# Altium project MainPCBV6.PrjPcb
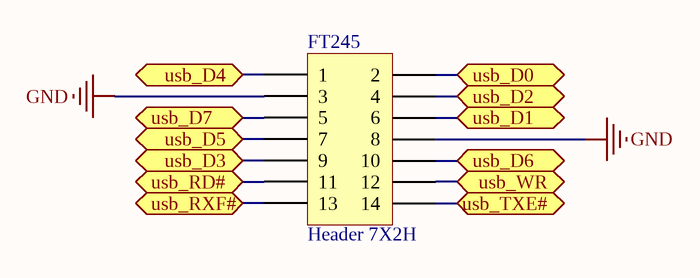
[diagram p0: FT245.SchDoc]
3 sheets, 46 parts. Net scope: flat (ports and power ports of the same name join across sheets).
Board file: MainPCBV6.PcbDoc
Sheets:
  FT245.SchDoc
  Led.SchDoc
  XC3S400.SchDoc

## Sheet FT245.SchDoc
size A4

### Parts
FT245  Header 7X2H  [HDR2X7]

### Ports
usb_D0, usb_D1, usb_D2, usb_D3, usb_D4, usb_D5, usb_D6, usb_D7, usb_RD#, usb_RXF#, usb_TXE#, usb_WR

### Nets
GND: FT245.3 FT245.8
NetFT245_1: FT245.1 ; port usb_D4
NetFT245_2: FT245.2 ; port usb_D0
NetFT245_4: FT245.4 ; port usb_D2
NetFT245_5: FT245.5 ; port usb_D7
NetFT245_6: FT245.6 ; port usb_D1
NetFT245_7: FT245.7 ; port usb_D5
NetFT245_9: FT245.9 ; port usb_D3
NetFT245_10: FT245.10 ; port usb_D6
NetFT245_11: FT245.11 ; port usb_RD#
NetFT245_12: FT245.12 ; port usb_WR
NetFT245_13: FT245.13 ; port usb_RXF#
NetFT245_14: FT245.14 ; port usb_TXE#

### Library data of the parts
FT245 = Header 7X2H: Header, 7-Pin, Dual row, Right Angle; LatestRevisionDate: 17-Jul-2002; LatestRevisionNote: Re-released for DXP Platform.; Publisher: Altium Limited

## Sheet Led.SchDoc
size A
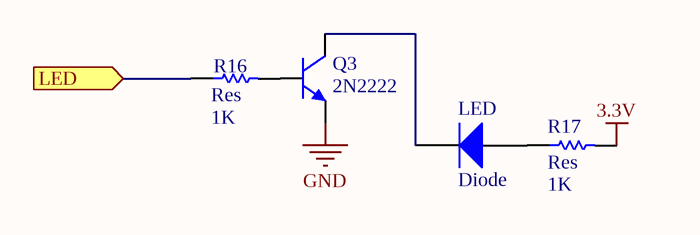
[diagram p1: Led.SchDoc]

### Parts
LED  Diode  [2012[0805]]
Q3  2N2222  [SOT-23]
R16  Res  value 1K  [2012[0805]]
R17  Res  value 1K  [2012[0805]]

### Ports
LED (in)

### Nets
3.3V: R17.2
GND: Q3.3(E)
NetLED_1: LED.1(A) R17.1
NetLED_2: LED.2(K) Q3.1(C)
NetQ3_2: Q3.2(B) R16.2
NetR16_1: R16.1 ; port LED

### Library data of the parts
LED = Diode: 1 Amp General Purpose Rectifier; Revision 1: 11-Jul-2000: SIM Model Added.; Revision 2: 17-Jul-2002: Re-released for DXP Platform.; Package Information: Latest Revision: Aug-1999; Code - JEDEC: DO-204-AL; Published: 8-Jun-2000; Datasheet: Latest Revision: 1998; Package Reference: DO-41; Publisher: Altium Limited
Q3 = 2N2222: NPN Bipolar Transistor; Published: 8-Jun-2000; LatestRevisionDate: 17-Jul-2002; LatestRevisionNote: Re-released for DXP Platform.; PackageReference: TO-226; Publisher: Altium Limited; Code_JEDEC: TO-226-AA
R16 R17 = Res: Semiconductor Resistor; Published: 8-Jun-2000; LatestRevisionDate: 17-Jul-2002; LatestRevisionNote: Re-released for DXP Platform.; PackageReference: AXIAL-0.5; Publisher: Altium Limited

## Sheet XC3S400.SchDoc
size B
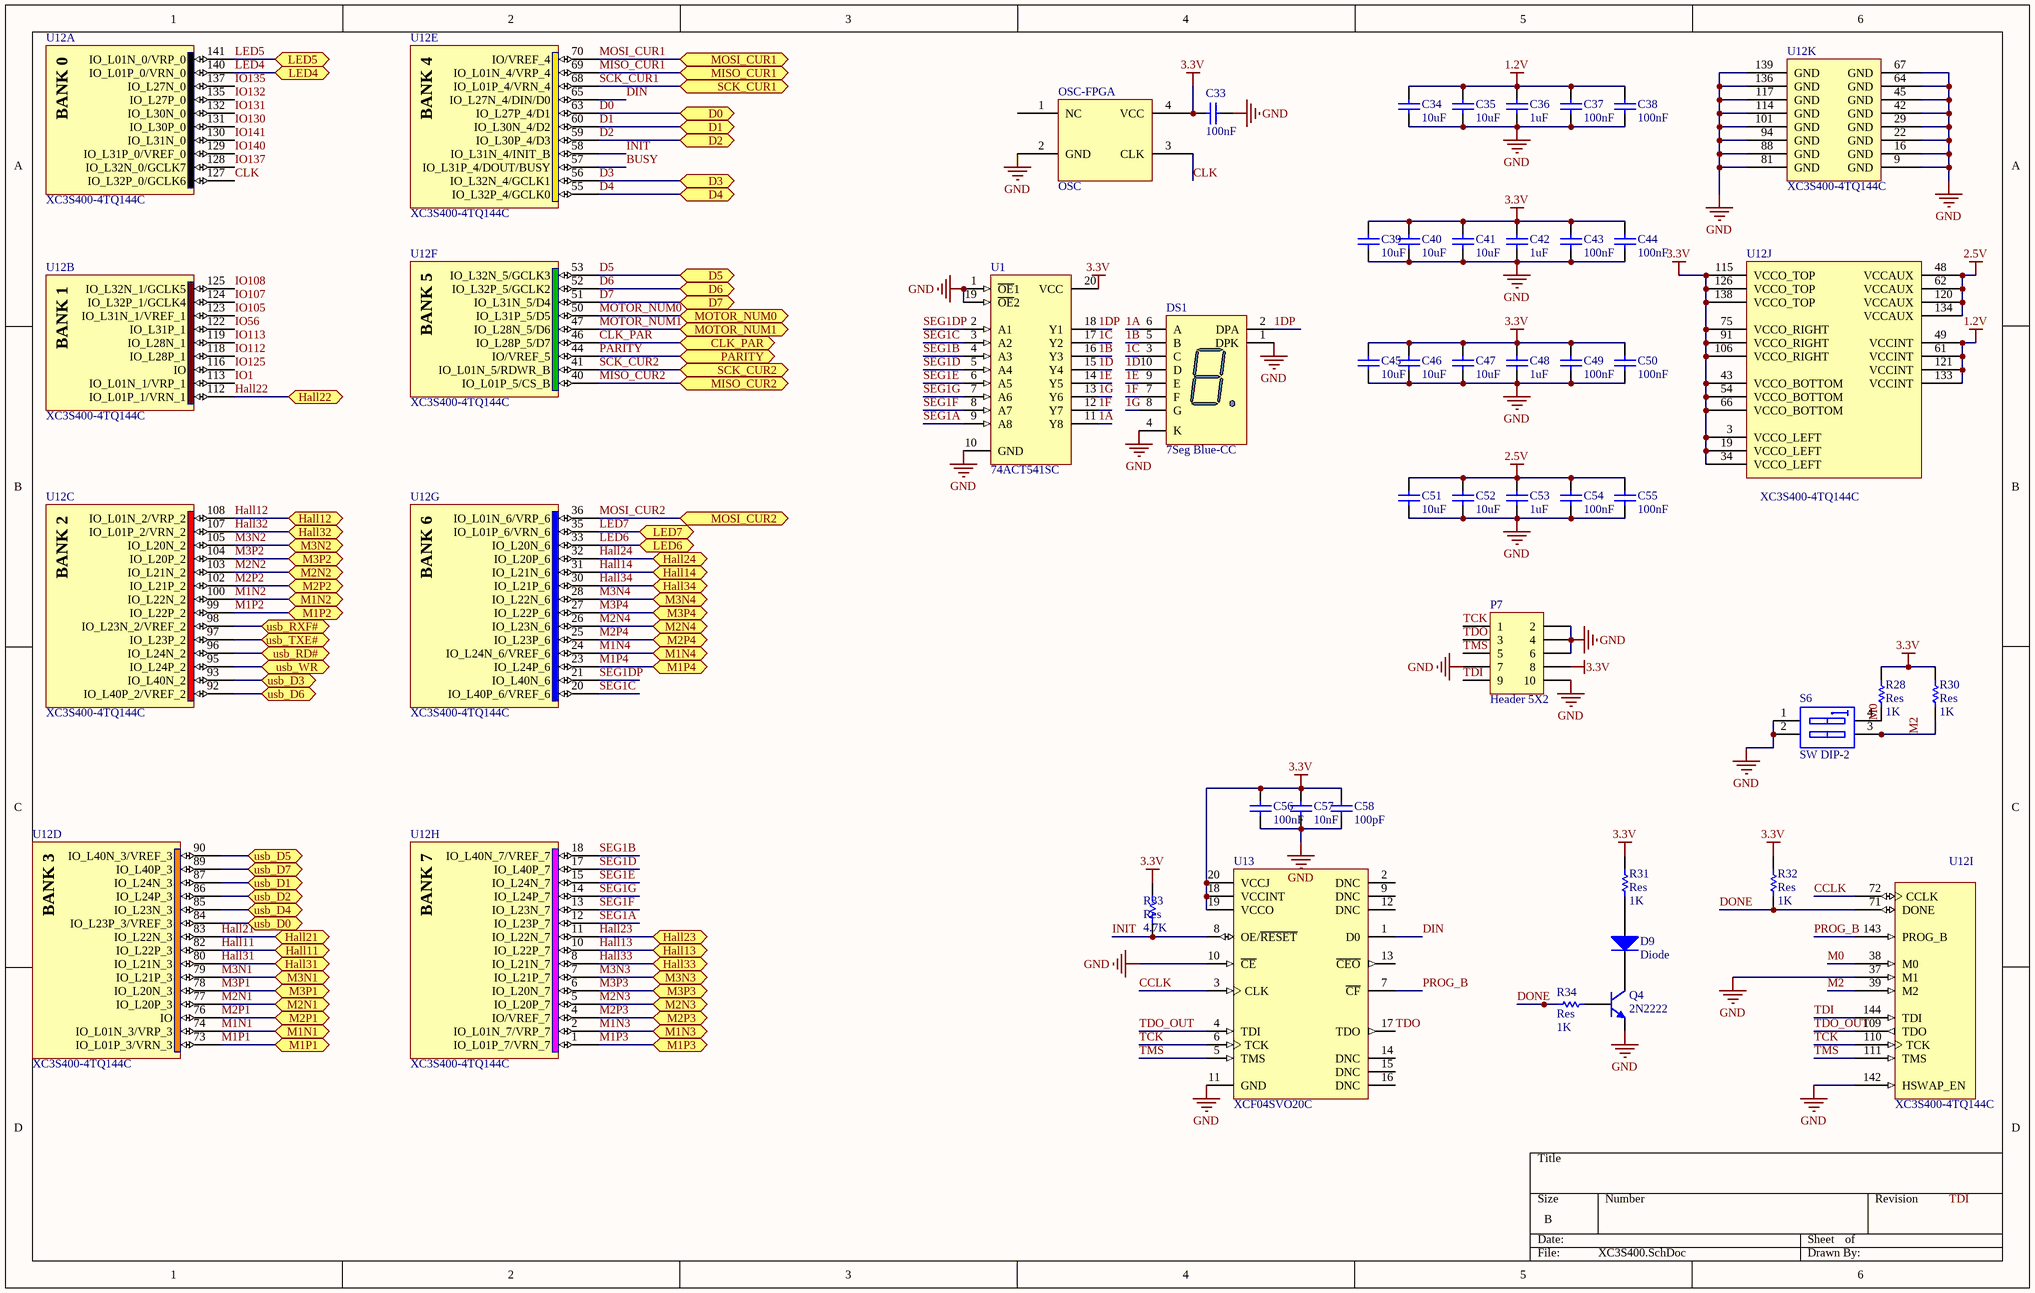
[diagram p2: XC3S400.SchDoc]

### Parts
C33  value 100nF  [2012[0805]]  (hidden comment: Cap_UP)
C34  value 10uF  [2012[0805]]  (hidden comment: Cap_UP)
C35  value 10uF  [2012[0805]]  (hidden comment: Cap_UP)
C36  value 1uF  [2012[0805]]  (hidden comment: Cap_UP)
C37  value 100nF  [2012[0805]]  (hidden comment: Cap_UP)
C38  value 100nF  [2012[0805]]  (hidden comment: Cap_UP)
C39  value 10uF  [2012[0805]]  (hidden comment: Cap_UP)
C40  value 10uF  [2012[0805]]  (hidden comment: Cap_UP)
C41  value 10uF  [2012[0805]]  (hidden comment: Cap_UP)
C42  value 1uF  [2012[0805]]  (hidden comment: Cap_UP)
C43  value 100nF  [2012[0805]]  (hidden comment: Cap_UP)
C44  value 100nF  [2012[0805]]  (hidden comment: Cap_UP)
C45  value 10uF  [2012[0805]]  (hidden comment: Cap_UP)
C46  value 10uF  [2012[0805]]  (hidden comment: Cap_UP)
C47  value 10uF  [2012[0805]]  (hidden comment: Cap_UP)
C48  value 1uF  [2012[0805]]  (hidden comment: Cap_UP)
C49  value 100nF  [2012[0805]]  (hidden comment: Cap_UP)
C50  value 100nF  [2012[0805]]  (hidden comment: Cap_UP)
C51  value 10uF  [2012[0805]]  (hidden comment: Cap_UP)
C52  value 10uF  [2012[0805]]  (hidden comment: Cap_UP)
C53  value 1uF  [2012[0805]]  (hidden comment: Cap_UP)
C54  value 100nF  [2012[0805]]  (hidden comment: Cap_UP)
C55  value 100nF  [2012[0805]]  (hidden comment: Cap_UP)
C56  value 100nF  [2012[0805]]  (hidden comment: Cap_UP)
C57  value 10nF  [2012[0805]]  (hidden comment: Cap_UP)
C58  value 100pF  [2012[0805]]  (hidden comment: Cap_UP)
D9  Diode  [2012[0805]]
DS1  7Seg Blue-CC  [7Segment Small]
OSC-FPGA  OSC  [OSC_square]
P7  Header 5X2  [HDR2X5]
Q4  2N2222  [SOT-23]
R28  Res  value 1K  [2012[0805]]
R30  Res  value 1K  [2012[0805]]
R31  Res  value 1K  [2012[0805]]
R32  Res  value 1K  [2012[0805]]
R33  Res  value 4.7K  [2012[0805]]
R34  Res  value 1K  [2012[0805]]
S6  SW DIP-2  [DIP-4]
U1  74ACT541SC  [M20B_M]
U12  XC3S400-4TQ144C  [TQ144_N]  (parts A,B,C,D,E,F,G,H,I,J,K of 11)
U13  XCF04SVO20C  [VO20_N]

### Ports
CLK_PAR, D0, D1, D2, D3, D4, D5, D6, D7, Hall11, Hall12, Hall13, Hall14, Hall21, Hall22, Hall23, Hall24, Hall31, Hall32, Hall33, Hall34, LED4, LED5, LED6, LED7, M1N1, M1N2, M1N3, M1N4, M1P1, M1P2, M1P3, M1P4, M2N1, M2N2, M2N3, M2N4, M2P1, M2P2, M2P3, M2P4, M3N1, M3N2, M3N3, M3N4, M3P1, M3P2, M3P3, M3P4, MISO_CUR1, MISO_CUR2, MOSI_CUR1, MOSI_CUR2, MOTOR_NUM0, MOTOR_NUM1, PARITY, SCK_CUR1, SCK_CUR2, usb_D0, usb_D1, usb_D2, usb_D3, usb_D4, usb_D5, usb_D6, usb_D7, usb_RD#, usb_RXF#, usb_TXE#, usb_WR

### Nets
1.2V: C34.2 C35.2 C36.2 C37.2 C38.2 U12.49(VCCINT) U12.61(VCCINT) U12.121(VCCINT) U12.133(VCCINT)
2.5V: C51.2 C52.2 C53.2 C54.2 C55.2 U12.48(VCCAUX) U12.62(VCCAUX) U12.120(VCCAUX) U12.134(VCCAUX)
3.3V: C33.1 C39.2 C40.2 C41.2 C42.2 C43.2 C44.2 C45.2 C46.2 C47.2 C48.2 C49.2 C50.2 C56.2 C57.2 C58.2 OSC-FPGA.4(VCC) P7.8 R28.2 R30.2 R31.2 R32.2 R33.2 U1.20(VCC) U12.3(VCCO_LEFT) U12.19(VCCO_LEFT) U12.34(VCCO_LEFT) U12.43(VCCO_BOTTOM) U12.54(VCCO_BOTTOM) U12.66(VCCO_BOTTOM) U12.75(VCCO_RIGHT) U12.91(VCCO_RIGHT) U12.106(VCCO_RIGHT) U12.115(VCCO_TOP) U12.126(VCCO_TOP) U12.138(VCCO_TOP) U13.18(VCCINT) U13.19(VCCO) U13.20(VCCJ)
GND: C33.2 C34.1 C35.1 C36.1 C37.1 C38.1 C39.1 C40.1 C41.1 C42.1 C43.1 C44.1 C45.1 C46.1 C47.1 C48.1 C49.1 C50.1 C51.1 C52.1 C53.1 C54.1 C55.1 C56.1 C57.1 C58.1 DS1.1(DPK) DS1.4(K) OSC-FPGA.2(GND) P7.2 P7.4 P7.6 P7.7 P7.10 Q4.3(E) S6.1(A1) S6.2(A2) U1.1(~{OE}1) U1.10(GND) U1.19(~{OE}2) U12.9(GND) U12.16(GND) U12.22(GND) U12.29(GND) U12.37(M1) U12.42(GND) U12.45(GND) U12.64(GND) U12.67(GND) U12.81(GND) U12.88(GND) U12.94(GND) U12.101(GND) U12.114(GND) U12.117(GND) U12.136(GND) U12.139(GND) U12.142(HSWAP_EN) U13.10(~{CE}) U13.11(GND)
1A: DS1.6(A) U1.11(Y8)
1B: DS1.5(B) U1.16(Y3)
1C: DS1.3(C) U1.17(Y2)
1D: DS1.10(D) U1.15(Y4)
1DP: DS1.2(DPA) U1.18(Y1)
1E: DS1.9(E) U1.14(Y5)
1F: DS1.7(F) U1.12(Y7)
1G: DS1.8(G) U1.13(Y6)
BUSY: U12.57(IO_L31P_4/DOUT/BUSY)
CCLK: U12.72(CCLK) U13.3(CLK)
CLK: OSC-FPGA.3(CLK) U12.127(IO_L32P_0/GCLK6)
CLK_PAR: U12.46(IO_L28P_5/D7) ; port CLK_PAR
D0: U12.63(IO_L27P_4/D1) ; port D0
D1: U12.60(IO_L30N_4/D2) ; port D1
D2: U12.59(IO_L30P_4/D3) ; port D2
D3: U12.56(IO_L32N_4/GCLK1) ; port D3
D4: U12.55(IO_L32P_4/GCLK0) ; port D4
D5: U12.53(IO_L32N_5/GCLK3) ; port D5
D6: U12.52(IO_L32P_5/GCLK2) ; port D6
D7: U12.51(IO_L31N_5/D4) ; port D7
DIN: U12.65(IO_L27N_4/DIN/D0) U13.1(D0)
DONE: R32.1 R34.1 U12.71(DONE)
Hall11: U12.82(IO_L22P_3) ; port Hall11
Hall12: U12.108(IO_L01N_2/VRP_2) ; port Hall12
Hall13: U12.10(IO_L22P_7) ; port Hall13
Hall14: U12.31(IO_L21N_6) ; port Hall14
Hall21: U12.83(IO_L22N_3) ; port Hall21
Hall22: U12.112(IO_L01P_1/VRN_1) ; port Hall22
Hall23: U12.11(IO_L22N_7) ; port Hall23
Hall24: U12.32(IO_L20P_6) ; port Hall24
Hall31: U12.80(IO_L21N_3) ; port Hall31
Hall32: U12.107(IO_L01P_2/VRN_2) ; port Hall32
Hall33: U12.8(IO_L21N_7) ; port Hall33
Hall34: U12.30(IO_L21P_6) ; port Hall34
INIT: R33.1 U12.58(IO_L31N_4/INIT_B) U13.8(OE/~{RESET})
IO1: U12.113(IO_L01N_1/VRP_1)
IO56: U12.122(IO_L31P_1)
IO105: U12.123(IO_L31N_1/VREF_1)
IO107: U12.124(IO_L32P_1/GCLK4)
IO108: U12.125(IO_L32N_1/GCLK5)
IO112: U12.118(IO_L28P_1)
IO113: U12.119(IO_L28N_1)
IO125: U12.116(IO)
IO130: U12.131(IO_L30P_0)
IO131: U12.132(IO_L30N_0)
IO132: U12.135(IO_L27P_0)
IO135: U12.137(IO_L27N_0)
IO137: U12.128(IO_L32N_0/GCLK7)
IO140: U12.129(IO_L31P_0/VREF_0)
IO141: U12.130(IO_L31N_0)
LED4: U12.140(IO_L01P_0/VRN_0) ; port LED4
LED5: U12.141(IO_L01N_0/VRP_0) ; port LED5
LED6: U12.33(IO_L20N_6) ; port LED6
LED7: U12.35(IO_L01P_6/VRN_6) ; port LED7
M0: R28.1 S6.4(B1) U12.38(M0)
M1N1: U12.74(IO_L01N_3/VRP_3) ; port M1N1
M1N2: U12.100(IO_L22N_2) ; port M1N2
M1N3: U12.2(IO_L01N_7/VRP_7) ; port M1N3
M1N4: U12.24(IO_L24N_6/VREF_6) ; port M1N4
M1P1: U12.73(IO_L01P_3/VRN_3) ; port M1P1
M1P2: U12.99(IO_L22P_2) ; port M1P2
M1P3: U12.1(IO_L01P_7/VRN_7) ; port M1P3
M1P4: U12.23(IO_L24P_6) ; port M1P4
M2: R30.1 S6.3(B2) U12.39(M2)
M2N1: U12.77(IO_L20P_3) ; port M2N1
M2N2: U12.103(IO_L21N_2) ; port M2N2
M2N3: U12.5(IO_L20P_7) ; port M2N3
M2N4: U12.26(IO_L23N_6) ; port M2N4
M2P1: U12.76(IO) ; port M2P1
M2P2: U12.102(IO_L21P_2) ; port M2P2
M2P3: U12.4(IO/VREF_7) ; port M2P3
M2P4: U12.25(IO_L23P_6) ; port M2P4
M3N1: U12.79(IO_L21P_3) ; port M3N1
M3N2: U12.105(IO_L20N_2) ; port M3N2
M3N3: U12.7(IO_L21P_7) ; port M3N3
M3N4: U12.28(IO_L22N_6) ; port M3N4
M3P1: U12.78(IO_L20N_3) ; port M3P1
M3P2: U12.104(IO_L20P_2) ; port M3P2
M3P3: U12.6(IO_L20N_7) ; port M3P3
M3P4: U12.27(IO_L22P_6) ; port M3P4
MISO_CUR1: U12.69(IO_L01N_4/VRP_4) ; port MISO_CUR1
MISO_CUR2: U12.40(IO_L01P_5/CS_B) ; port MISO_CUR2
MOSI_CUR1: U12.70(IO/VREF_4) ; port MOSI_CUR1
MOSI_CUR2: U12.36(IO_L01N_6/VRP_6) ; port MOSI_CUR2
MOTOR_NUM0: U12.50(IO_L31P_5/D5) ; port MOTOR_NUM0
MOTOR_NUM1: U12.47(IO_L28N_5/D6) ; port MOTOR_NUM1
PARITY: U12.44(IO/VREF_5) ; port PARITY
PROG_B: U12.143(PROG_B) U13.7(~{CF})
SCK_CUR1: U12.68(IO_L01P_4/VRN_4) ; port SCK_CUR1
SCK_CUR2: U12.41(IO_L01N_5/RDWR_B) ; port SCK_CUR2
SEG1A: U1.9(A8) U12.12(IO_L23P_7)
SEG1B: U1.4(A3) U12.18(IO_L40N_7/VREF_7)
SEG1C: U1.3(A2) U12.20(IO_L40P_6/VREF_6)
SEG1D: U1.5(A4) U12.17(IO_L40P_7)
SEG1DP: U1.2(A1) U12.21(IO_L40N_6)
SEG1E: U1.6(A5) U12.15(IO_L24N_7)
SEG1F: U1.8(A7) U12.13(IO_L23N_7)
SEG1G: U1.7(A6) U12.14(IO_L24P_7)
TCK: P7.1 U12.110(TCK) U13.6(TCK)
TDI: P7.9 U12.144(TDI)
TDO: P7.3 U13.17(TDO)
TDO_OUT: U12.109(TDO) U13.4(TDI)
TMS: P7.5 U12.111(TMS) U13.5(TMS)
NetD9_1: D9.1(A) R31.1
NetD9_2: D9.2(K) Q4.1(C)
NetFT245_1: U12.85(IO_L23N_3) ; port usb_D4
NetFT245_2: U12.84(IO_L23P_3/VREF_3) ; port usb_D0
NetFT245_4: U12.86(IO_L24P_3) ; port usb_D2
NetFT245_5: U12.89(IO_L40P_3) ; port usb_D7
NetFT245_6: U12.87(IO_L24N_3) ; port usb_D1
NetFT245_7: U12.90(IO_L40N_3/VREF_3) ; port usb_D5
NetFT245_9: U12.93(IO_L40N_2) ; port usb_D3
NetFT245_10: U12.92(IO_L40P_2/VREF_2) ; port usb_D6
NetFT245_11: U12.96(IO_L24N_2) ; port usb_RD#
NetFT245_12: U12.95(IO_L24P_2) ; port usb_WR
NetFT245_13: U12.98(IO_L23N_2/VREF_2) ; port usb_RXF#
NetFT245_14: U12.97(IO_L23P_2) ; port usb_TXE#
NetQ4_2: Q4.2(B) R34.2

Not connected (* = marked no-connect by the designer): OSC-FPGA 1(NC); U13 2(DNC) 9(DNC) 12(DNC) 13(~{CEO}) 14(DNC) 15(DNC) 16(DNC)

### Notes on the sheet
- Labels drawn without touching a wire or pin: TDI
- (in symbol XC3S400-4TQ144C, part A) BANK 0
- (in symbol XC3S400-4TQ144C, part B) BANK 1
- (in symbol XC3S400-4TQ144C, part C) BANK 2
- (in symbol XC3S400-4TQ144C, part D) BANK 3
- (in symbol XC3S400-4TQ144C, part E) BANK 4
- (in symbol XC3S400-4TQ144C, part F) BANK 5
- (in symbol XC3S400-4TQ144C, part G) BANK 6
- (in symbol XC3S400-4TQ144C, part H) BANK 7

### Library data of the parts
C33-C58 = Cap_UP: Capacitor; Published: 8-Jun-2000; LatestRevisionDate: 17-Jul-2002; LatestRevisionNote: Re-released for DXP Platform.; PackageReference: RAD-0.3; Publisher: Altium Limited
D9 = Diode: as LED on sheet Led; Published: 8-Jun-2000; Datasheet: Latest Revision: 1998; Package Reference: DO-41; Publisher: Altium Limited
DS1 = 7Seg Blue-CC_1: 14.2 mm General Purpose Blue 7-Segment Display: CC, RH DP, Gray Surface; MinimumIntensity: 2020 ucd; Note: IF = 10 mA; Published: 8-Jun-2000; LatestRevisionDate: 17-Dec-2003; LatestRevisionNote: Schematic revised, PCB Footprint replaced.; DatasheetDocument: 24-Sep-2002; PackageDocument: 24-Sep-2002; PackageReference: H; Publisher: Altium Limited; Colour: Blue; ComponentLink1Description: Manufacturer Link; ComponentLink1URL: http://www.agilent.com/
P7 = Header 5X2: Header, 5-Pin, Dual row; LatestRevisionDate: 17-Jul-2002; LatestRevisionNote: Re-released for DXP Platform.; Publisher: Altium Limited
Q4 = 2N2222: NPN Bipolar Transistor; Published: 8-Jun-2000; LatestRevisionDate: 17-Jul-2002; LatestRevisionNote: Re-released for DXP Platform.; PackageReference: TO-226; Publisher: Altium Limited; Code_JEDEC: TO-226-AA
R28 R30-R34 = Res: Semiconductor Resistor; Published: 8-Jun-2000; LatestRevisionDate: 17-Jul-2002; LatestRevisionNote: Re-released for DXP Platform.; PackageReference: AXIAL-0.5; Publisher: Altium Limited
S6 = SW DIP-2: DIP Switch, 2 Position, SPST; Published: 24-Mar-1999; LatestRevisionDate: 17-Jul-2002; LatestRevisionNote: Re-released for DXP Platform.; PackageReference: DIP-4; Publisher: Altium Limited
U1 = 74ACT541SC: Octal Buffer/Line Driver with 3-State Output; Published: 17-Jul-2002; LatestRevisionDate: 13-Apr-2006; LatestRevisionNote: IPC-7351 Footprint Added.; DatasheetVersion: Oct-1999; PackageVersion: 2000; PackageReference: M20B; Publisher: Altium Limited; PackageDescription: 20-Pin Small Outline Integrated Circuit 1.27 mm Pitch; Code_JEDEC: MS-013-AC; Code_IPC: SOIC127P1030-20; ComponentLink1Description: Manufacturer Link; ComponentLink1URL: http://www.fairchildsemi.com/; ComponentLink2Description: Datasheet; ComponentLink2URL: http://www.fairchildsemi.com/ds/74%2F74AC541.pdf
U12 = XC3S400-4TQ144C: Spartan-3 1.2V FPGA, 97 User I/Os, 144-Pin TQFP, Standard Performance, Commercial Grade; OrderingInformation: Additional code may have to be appended for different mask revision devices.; Published: 17-Sep-2003; LatestRevisionDate: 01-Mar-2010; LatestRevisionNote: Updated to datasheet version 2.5 Dec-2009.; DatasheetVersion: ver2.5, Dec-2009; PackageVersion: ver1.2, Jun-2004; PackageReference: TQ144; Publisher: Altium Limited; PackageDescription: 144-Pin Thin Quad Flat Pack (TQ144); Code_JEDEC: MS-026-BFB; ComponentLink1Description: Spartan-3 Datasheet; ComponentLink1URL: http://www.xilinx.com/support/documentation/data_sheets/ds099.pdf; ComponentLink2Description: TQ144 Package Drawing; ComponentLink2URL: http://www.xilinx.com/support/documentation/package_specs/tq144.pdf; ComponentLink3Description: Spartan-3 Documents; ComponentLink3URL: http://www.xilinx.com/support/documentation/spartan-3.htm; ComponentLink4Description: Xilinx.com Home; ComponentLink4URL: http://www.xilinx.com
U13 = XCF04SVO20C: XCF00S Series, Platform Flash In-System Programmable Configuration 3.3V PROM, 20-Pin TSOP, 4-Megabit, Commercial Grade; Published: 17-Sep-2003; LatestRevisionDate: 16-Nov-2009; LatestRevisionNote: Updated to datasheet version 2.17, Oct-2009.; DatasheetVersion: ver2.17, Oct-2009; PackageVersion: ver1.3, Dec-2008; PackageReference: VO20; Publisher: Altium Limited; PackageDescription: 20-Pin Thin Shrink Small Outline Package (VO20); Supplier 1: Digi-Key; Supplier Part Number 1: XCF04SVO20C-ND; Code_JEDEC: MO-153-AC; ComponentLink1Description: Platform Flash Datasheet; ComponentLink1URL: http://www.xilinx.com/support/documentation/data_sheets/ds123.pdf; ComponentLink2Description: VO20 Package Drawing; ComponentLink2URL: http://www.xilinx.com/support/documentation/package_specs/vo20.pdf; ComponentLink3Description: Configuration PROM Documents; ComponentLink3URL: http://www.xilinx.com/support/documentation/configuration_proms.htm; ComponentLink4Description: Xilinx.com Home; ComponentLink4URL: http://www.xilinx.com

## Nets that join several sheets
3.3V: Led (R17.2), XC3S400 (39 pins)
GND: FT245 (FT245.3 FT245.8), Led (Q3.3), XC3S400 (60 pins)
NetFT245_1: FT245 (FT245.1), XC3S400 (U12.85)
NetFT245_2: FT245 (FT245.2), XC3S400 (U12.84)
NetFT245_4: FT245 (FT245.4), XC3S400 (U12.86)
NetFT245_5: FT245 (FT245.5), XC3S400 (U12.89)
NetFT245_6: FT245 (FT245.6), XC3S400 (U12.87)
NetFT245_7: FT245 (FT245.7), XC3S400 (U12.90)
NetFT245_9: FT245 (FT245.9), XC3S400 (U12.93)
NetFT245_10: FT245 (FT245.10), XC3S400 (U12.92)
NetFT245_11: FT245 (FT245.11), XC3S400 (U12.96)
NetFT245_12: FT245 (FT245.12), XC3S400 (U12.95)
NetFT245_13: FT245 (FT245.13), XC3S400 (U12.98)
NetFT245_14: FT245 (FT245.14), XC3S400 (U12.97)